# Altium schematic sheet Sheet1.SchDoc
size A2; SheetNumber: 1; SheetTotal: 1
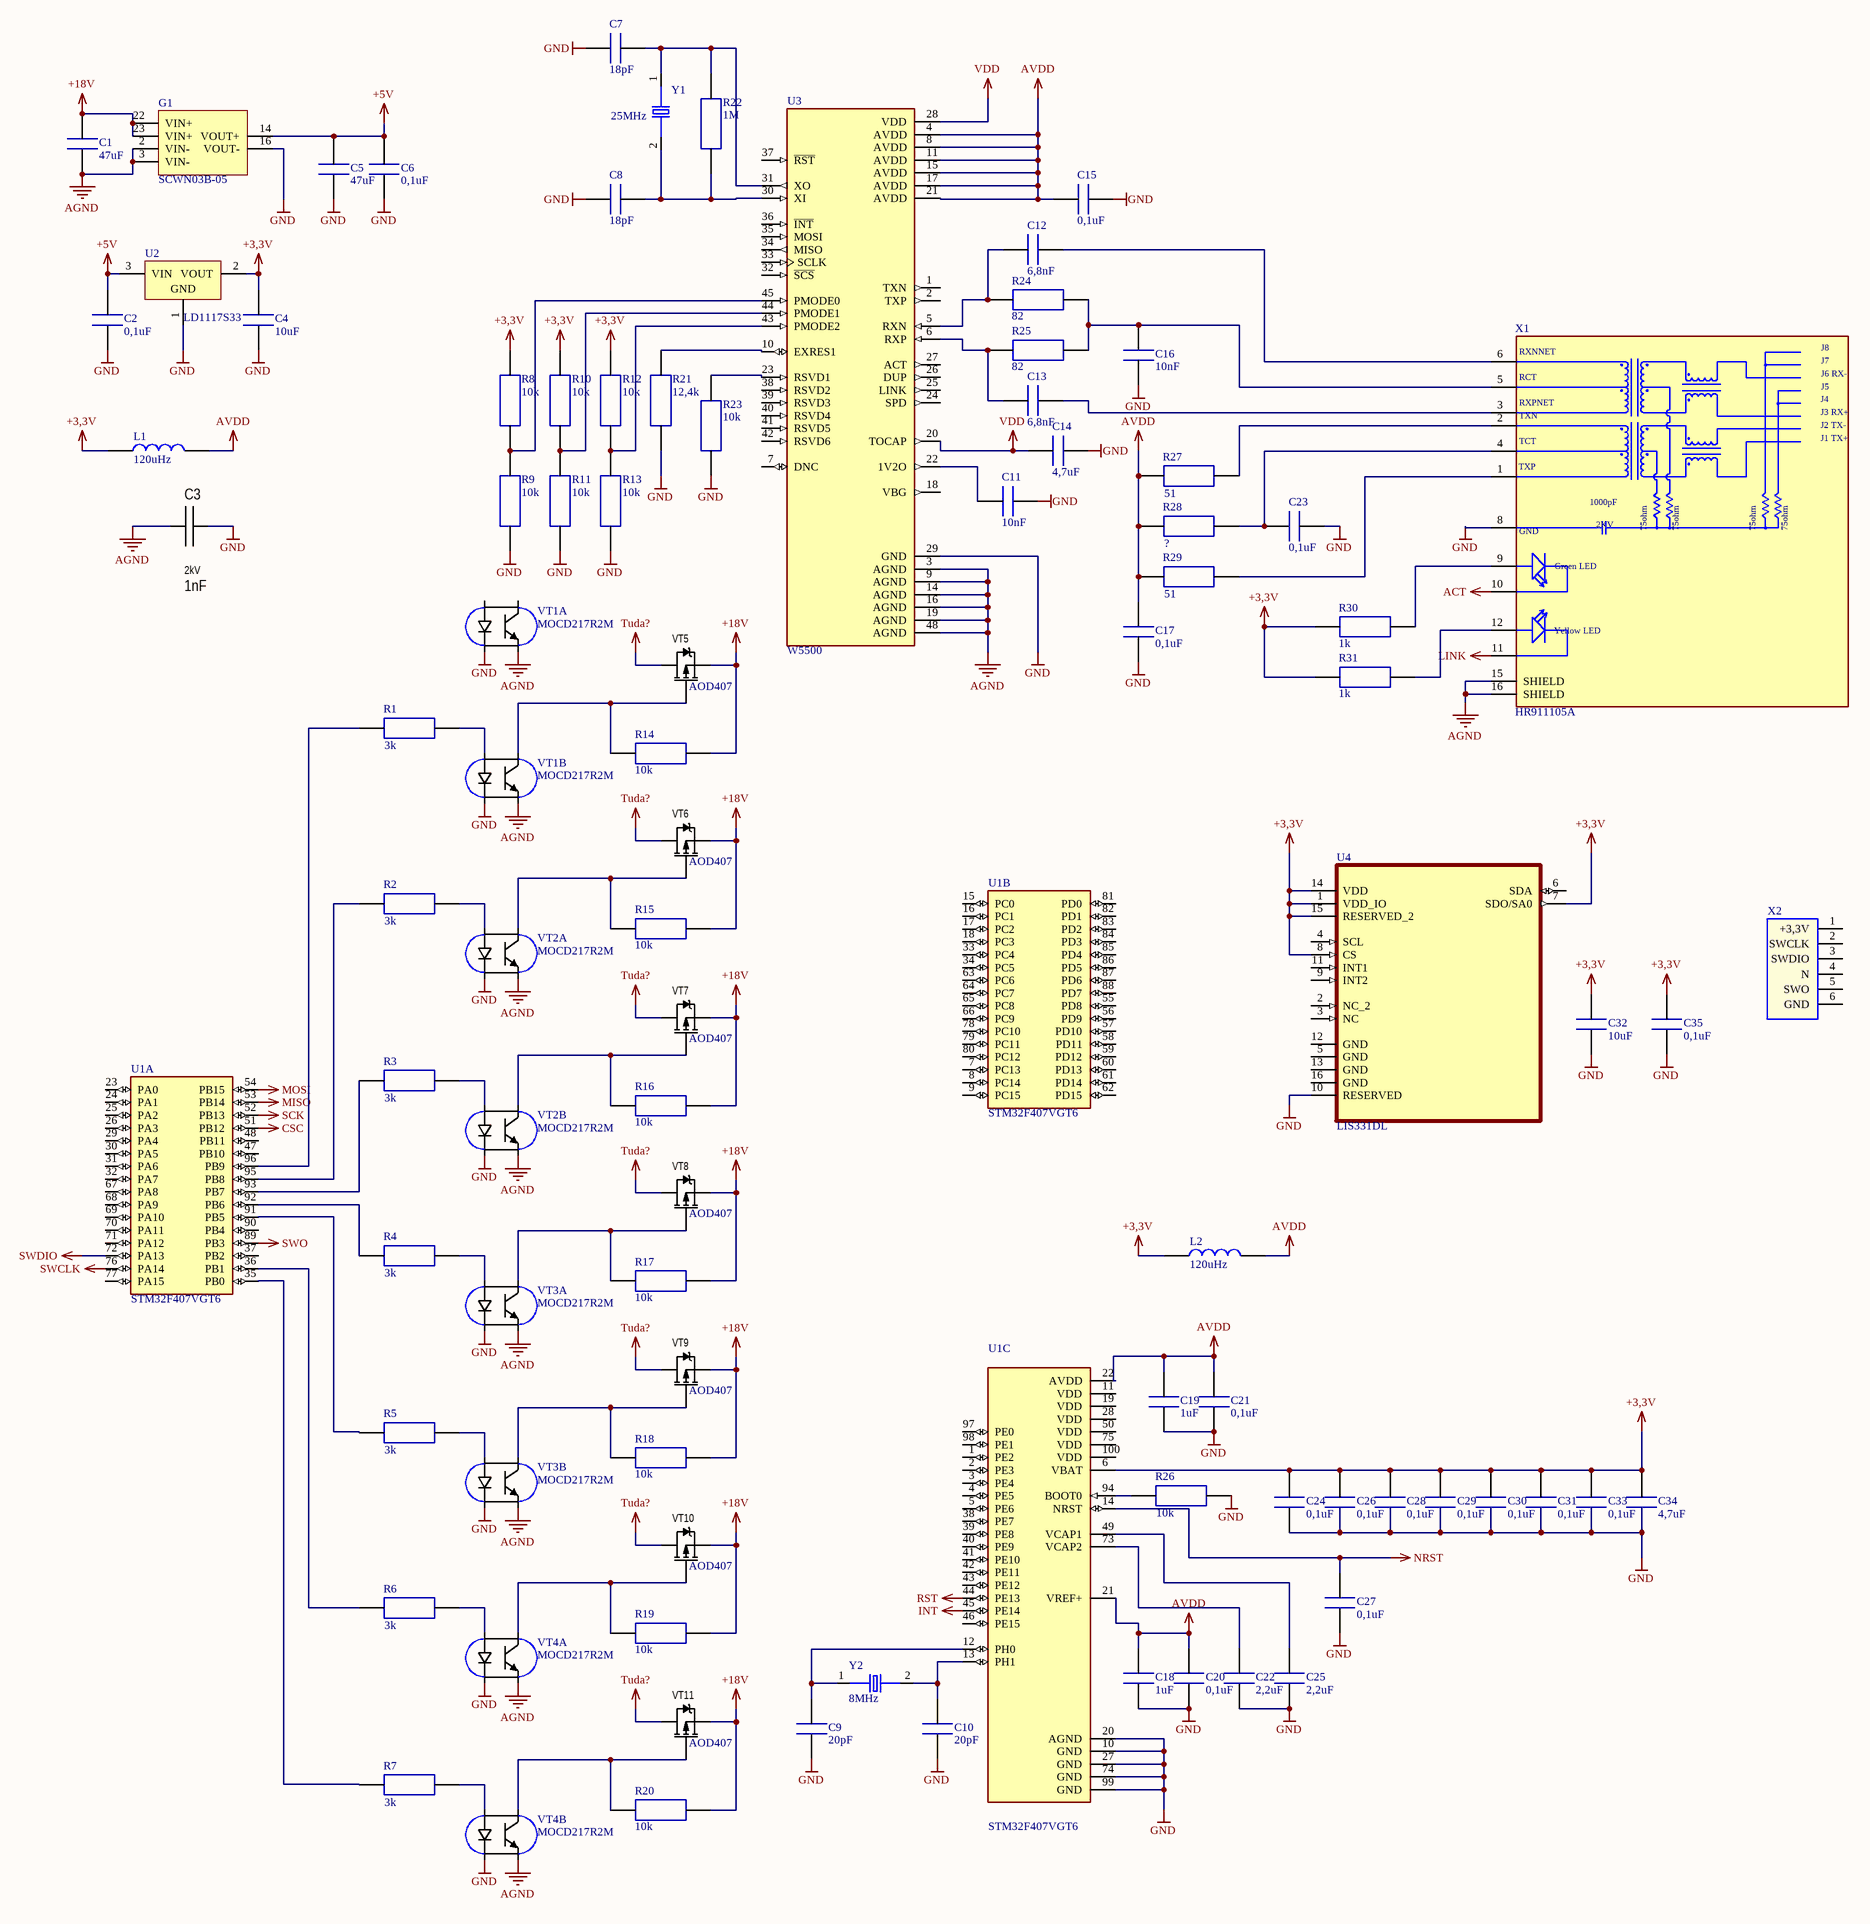
[diagram p0: Sheet1.SchDoc]

## Parts
C1  47uF  [0603]
C2  0,1uF  [0603]
C3  value 1nF  Voltage: 2kV  [CAP: 1206]
C4  10uF  [0603]
C5  47uF  [0603]
C6  0,1uF  [0603]
C7  18pF  [0603]
C8  18pF  [0603]
C9  20pF  [0603]
C10  20pF  [0603]
C11  10nF  [0603]
C12  6,8nF  [0603]
C13  6,8nF  [0603]
C14  4,7uF  [0603]
C15  0,1uF  [0603]
C16  10nF  [0603]
C17  0,1uF  [0603]
C18  1uF  [0603]
C19  1uF  [0603]
C20  0,1uF  [0603]
C21  0,1uF  [0603]
C22  2,2uF  [0603]
C23  0,1uF  [0603]
C24  0,1uF  [0603]
C25  2,2uF  [0603]
C26  0,1uF  [0603]
C27  0,1uF  [0603]
C28  0,1uF  [0603]
C29  0,1uF  [0603]
C30  0,1uF  [0603]
C31  0,1uF  [0603]
C32  10uF  [0603]
C33  0,1uF  [0603]
C34  4,7uF  [0603]
C35  0,1uF  [0603]
G1  SCWN03B-05  [DIP]
L1  120uHz  [0603]
L2  120uHz  [0603]
R1  3k  [0603]
R2  3k  [0603]
R3  3k  [0603]
R4  3k  [0603]
R5  3k  [0603]
R6  3k  [0603]
R7  3k  [0603]
R8  10k  [0603]
R9  10k  [0603]
R10  10k  [0603]
R11  10k  [0603]
R12  10k  [0603]
R13  10k  [0603]
R14  10k  [0603]
R15  10k  [0603]
R16  10k  [0603]
R17  10k  [0603]
R18  10k  [0603]
R19  10k  [0603]
R20  10k  [0603]
R21  12,4k  [0603]
R22  1M  [0603]
R23  10k  [0603]
R24  82  [0603]
R25  82  [0603]
R26  10k  [0603]
R27  51  [0603]
R28  ?  [0603]
R29  51  [0603]
R30  1k  [0603]
R31  1k  [0603]
U1  STM32F407VGT6  [QFP50P1600X1600X160-100N]  (parts A,B,C of 3)
U2  LD1117S33  [SOT-223L]
U3  W5500  [QFP50P900X900X160-48N]
U4  LIS331DL  [LGA16R50P3X5_300X300X100]
VT1  MOCD217R2M  [SO-8]  (parts A,B of 2)
VT2  MOCD217R2M  [SO-8]  (parts A,B of 2)
VT3  MOCD217R2M  [SO-8]  (parts A,B of 2)
VT4  MOCD217R2M  [SO-8]  (parts A,B of 2)
VT5  AOD407  [SOT23]
VT6  AOD407  [SOT23]
VT7  AOD407  [SOT23]
VT8  AOD407  [SOT23]
VT9  AOD407  [SOT23]
VT10  AOD407  [SOT23]
VT11  AOD407  [SOT23]
X1  HR911105A  [HANRUN_HR911105A]
X2  PROG  [3x2x2,54]  (value not drawn)
Y1  25MHz  [XTAL1170X500X450]
Y2  8MHz  [XTAL1170X500X450]

## Nets
+3,3V: C4.2 C24.2 C26.2 C28.2 C29.2 C30.2 C31.2 C32.2 C33.2 C34.2 C35.2 L1.1 L2.1 R8.2 R10.2 R12.2 R30.1 R31.1 U1.6(VBAT) U2.2(VOUT) U4.1(VDD_IO) U4.7(SDO/SA0) U4.8(CS) U4.14(VDD) U4.15(RESERVED_2)
+5V: C2.2 C5.2 C6.2 G1.14(VOUT+) U2.3(VIN)
+18V: C1.2 G1.22(VIN+) G1.23(VIN+) R14.2 R15.2 R16.2 R17.2 R18.2 R19.2 R20.2 VT5.3(S) VT6.3(S) VT7.3(S) VT8.3(S) VT9.3(S) VT10.3(S) VT11.3(S)
ACT: X1.10(ACT)
AGND: C1.1 C3.1 G1.2(VIN-) G1.3(VIN-) U3.3(AGND) U3.9(AGND) U3.14(AGND) U3.16(AGND) U3.19(AGND) U3.48(AGND) VT1.5(E2) VT1.7(E1) VT2.5(E2) VT2.7(E1) VT3.5(E2) VT3.7(E1) VT4.5(E2) VT4.7(E1) X1.15(SHIELD) X1.16(SHIELD)
AVDD: C15.2 C17.1 C18.2 C19.2 C20.2 C21.2 L1.2 L2.2 R27.1 R28.1 R29.1 U1.21(VREF+) U1.22(AVDD) U3.4(AVDD) U3.8(AVDD) U3.11(AVDD) U3.15(AVDD) U3.17(AVDD) U3.21(AVDD)
CSC: U1.51(PB12)
GND: C2.1 C3.2 C4.1 C5.1 C6.1 C7.1 C8.1 C9.1 C10.1 C11.1 C14.1 C15.1 C16.2 C17.2 C18.1 C19.1 C20.1 C21.1 C22.1 C23.2 C24.1 C25.1 C26.1 C27.1 C28.1 C29.1 C30.1 C31.1 C32.1 C33.1 C34.1 C35.1 G1.16(VOUT-) R9.1 R11.1 R13.1 R21.1 R23.1 R26.2 U1.10(GND) U1.20(AGND) U1.27(GND) U1.74(GND) U1.99(GND) U2.1(GND) U3.29(GND) U4.10(RESERVED) VT1.2(Ca1) VT1.4(Ca2) VT2.2(Ca1) VT2.4(Ca2) VT3.2(Ca1) VT3.4(Ca2) VT4.2(Ca1) VT4.4(Ca2) X1.8(GND)
INT: U1.45(PE14)
LINK: X1.11(LINK)
MISO: U1.53(PB14)
MOSI: U1.54(PB15)
NRST: C27.2 U1.14(NRST)
RST: U1.44(PE13)
SCK: U1.52(PB13)
SWCLK: U1.76(PA14)
SWDIO: U1.72(PA13)
SWO: U1.89(PB3)
Tuda?: VT5.2(D) VT6.2(D) VT7.2(D) VT8.2(D) VT9.2(D) VT10.2(D) VT11.2(D)
VDD: C14.2 U3.20(TOCAP) U3.28(VDD)
NetC7_2: C7.2 R22.1 U3.31(XO) Y1.1
NetC8_2: C8.2 R22.2 U3.30(XI) Y1.2
NetC9_2: C9.2 U1.12(PH0) Y2.1
NetC10_2: C10.2 U1.13(PH1) Y2.2
NetC11_2: C11.2 U3.22(1V2O)
NetC12_1: C12.1 X1.6(RXNNET)
NetC12_2: C12.2 R24.1 U3.5(RXN)
NetC13_1: C13.1 X1.3(RXPNET)
NetC13_2: C13.2 R25.1 U3.6(RXP)
NetC16_1: C16.1 R24.2 R25.2 X1.5(RCT)
NetC22_2: C22.2 U1.73(VCAP2)
NetC23_1: C23.1 R28.2 X1.4(TCT)
NetC25_2: C25.2 U1.49(VCAP1)
NetR1_1: R1.1 U1.96(PB9)
NetR1_2: R1.2 VT1.3(A2)
NetR2_1: R2.1 U1.95(PB8)
NetR2_2: R2.2 VT2.1(A1)
NetR3_1: R3.1 U1.93(PB7)
NetR3_2: R3.2 VT2.3(A2)
NetR4_1: R4.1 U1.92(PB6)
NetR4_2: R4.2 VT3.1(A1)
NetR5_1: R5.1 U1.91(PB5)
NetR5_2: R5.2 VT3.3(A2)
NetR6_1: R6.1 U1.36(PB1)
NetR6_2: R6.2 VT4.1(A1)
NetR7_1: R7.1 U1.35(PB0)
NetR7_2: R7.2 VT4.3(A2)
NetR8_1: R8.1 R9.2 U3.45(PMODE0)
NetR10_1: R10.1 R11.2 U3.44(PMODE1)
NetR12_1: R12.1 R13.2 U3.43(PMODE2)
NetR14_1: R14.1 VT1.6(C2) VT5.1(G)
NetR15_1: R15.1 VT2.8(C1) VT6.1(G)
NetR16_1: R16.1 VT2.6(C2) VT7.1(G)
NetR17_1: R17.1 VT3.8(C1) VT8.1(G)
NetR18_1: R18.1 VT3.6(C2) VT9.1(G)
NetR19_1: R19.1 VT4.8(C1) VT10.1(G)
NetR20_1: R20.1 VT4.6(C2) VT11.1(G)
NetR21_2: R21.2 U3.10(EXRES1)
NetR23_2: R23.2 U3.23(RSVD1)
NetR26_1: R26.1 U1.94(BOOT0)
NetR27_2: R27.2 X1.2(TXN)
NetR29_2: R29.2 X1.1(TXP)
NetR30_2: R30.2 X1.9(GA)
NetR31_2: R31.2 X1.12(YA)

Not connected (* = marked no-connect by the designer): U1 1(PE2) 2(PE3) 3(PE4) 4(PE5) 5(PE6) 7(PC13) 8(PC14) 9(PC15) 11(VDD) 15(PC0) 16(PC1) 17(PC2) 18(PC3) 19(VDD) 23(PA0) 24(PA1) 25(PA2) 26(PA3) 28(VDD) 29(PA4) 30(PA5) 31(PA6) 32(PA7) 33(PC4) 34(PC5) 37(PB2) 38(PE7) 39(PE8) 40(PE9) 41(PE10) 42(PE11) 43(PE12) 46(PE15) 47(PB10) 48(PB11) 50(VDD) 55(PD8) 56(PD9) 57(PD10) 58(PD11) 59(PD12) 60(PD13) 61(PD14) 62(PD15) 63(PC6) 64(PC7) 65(PC8) 66(PC9) 67(PA8) 68(PA9) 69(PA10) 70(PA11) 71(PA12) 75(VDD) 77(PA15) 78(PC10) 79(PC11) 80(PC12) 81(PD0) 82(PD1) 83(PD2) 84(PD3) 85(PD4) 86(PD5) 87(PD6) 88(PD7) 90(PB4) 97(PE0) 98(PE1) 100(VDD); U3 1(TXN) 2(TXP) 7(DNC) 18(VBG) 24(SPD) 25(LINK) 26(DUP) 27(ACT) 32(~{SCS}) 33(SCLK) 34(MISO) 35(MOSI) 36(~{INT}) 37(~{RST}) 38(RSVD2) 39(RSVD3) 40(RSVD4) 41(RSVD5) 42(RSVD6); U4 2(NC_2) 3(NC) 4(SCL) 5(GND) 6(SDA) 9(INT2) 11(INT1) 12(GND) 13(GND) 16(GND); VT1 1(A1) 8(C1); X2 1(+3,3V) 2(SWCLK) 3(SWDIO) 4(N) 5(SWO) 6(GND)

## Notes on the sheet
- (in symbol HR911105A) J8; J7; J6 RX-; J5; J4; J3 RX+; J2 TX-; J1 TX+; 1000pF; 2KV; 75ohm; Green LED; Yellow LED

## Library data of the parts
C1 C2 C4-C35 = Cap
C3 = Ceramic_1206: Manufacturer: Yageo; PartNumber: CC1206KRX7R9BB104; ValueManufacturerPartNumber: Ceramic capacitor, 1nF, X7R, ±10%, 2kV, 1206, -55...+125°C; TypeCapacitor: Ceramic capacitor; Tolerance: ±10%; TypeDielectric: X7R; Package: 1206; HelpURL: https://www.digikey.com/product-detail/en/yageo/CC1206KRX7R9BB104/311-1179-1-ND/303089; Temperature: -55...+125°C
G1 = SCWN03B-05: DC-DC Regulated Converter DIP
L1 L2 = Ind
R1-R31 = Rez
U1 = STM32F407VGT6: ARMÂ® CortexÂ®-M4 STM32F4 Microcontroller IC 32-Bit 168MHz 1MB _1M x 8_ FLASH 100-LQFP _14x14_; MF: STMicroelectronics; Value: *; SnapEDA_Link: https://www.snapeda.com/parts/STM32F407VGT6/STMicroelectronics/view-part/106801/?ref=snap; MP: STM32F407VGT6; Availability: Unavailable; Price: None; Package: LQFP-100 STMicroelectronics
U2 = LD1117S33: Adjustable and fixed low drop positive voltage regulator, SOT-223
U3 = W5500: Socket Contact Silver 17-20 AWG Crimp Power; MF: WIZnet; Price: None; Package: LQFP-48 WIZnet; Value: *; MP: W5500; Availability: Unavailable; SnapEDA_Link: https://www.snapeda.com/parts/W5500/WIZnet/view-part/45250/?ref=snap
U4 = LIS331DL: ÐÐºÑÐµÐ»ÐµÑ€Ð¾Ð¼ÐµÑ‚Ñ€ Ð¿Ð¾ Ð¾ÑÑÐ¼ X, Y, Z Â± 2g, 4g, 8g 25 Ð“Ñ† ~ 500 Ð“Ñ† 16-LGA (3x3); MF: STMicroelectronics; Value: *; Availability: Bad; MP: LIS331DL; Price: None; Package: LGA-16 STMicroelectronics; SnapEDA_Link: https://www.snapeda.com/parts/LIS331DL/STMicroelectronics/view-part/494085/?ref=snap
VT1-VT4 = Opto
VT5-VT11 = MOSFET_P_123: Manufacturer: Infineon Technologies; ValueManufacturerPartNumber: MOSFET P-channel transistor, 20V, 2.6A, 2.9nC, 2.5W, 135mOhm, 220pF, SOT-23, -55...+150°C; PartNumber: IRLML2246TRPBF; TypeTransistor: MOSFET P-channel transistor; VoltageDS: 20V; CurrentDS: 2.6A; RDS: 135mOhm; GateCharge: 2.9nC; InputCapacitor: 220pF; MaxPower: 2.5W; Package: SOT-23; HelpURL: https://www.digikey.com/product-detail/en/infineon-technologies/IRLML2246TRPBF/IRLML2246TRPBFCT-ND/2639576; Temperature: -55...+150°C
X1 = HR911105A: HR911105A Ethernet Interface Arduino Platform Evaluation Expansion Board; MF: DFRobot; Package: None; Availability: Unavailable; MP: HR911105A; Value: *; SnapEDA_Link: https://www.snapeda.com/parts/HR911105A/DFRobot/view-part/214807/?ref=snap; Price: None
Y1 Y2 = FOXSDLF/245F-20: 24.576MHz Â±30ppm Crystal 20pF 30 Ohms HC-49/US; MF: Fox Electronics; Mouser-Purchase-URL: https://snapeda.com/shop?store=Mouser&id=105256; Value: *; Availability: Warning; Price: None; SnapEDA_Link: https://www.snapeda.com/parts/FOXSDLF/245F-20/Fox%20Electronics/view-part/105256/?ref=snap; Package: HC49SD Fox Electronics; MP: FOXSDLF/245F-20